# Altium schematic sheet NQX23103A-RX-V2.1-(N32WB031_QFN32_NU1680).SchDoc
size 469 x 330 mm; SheetNumber: 1; SheetTotal: 1
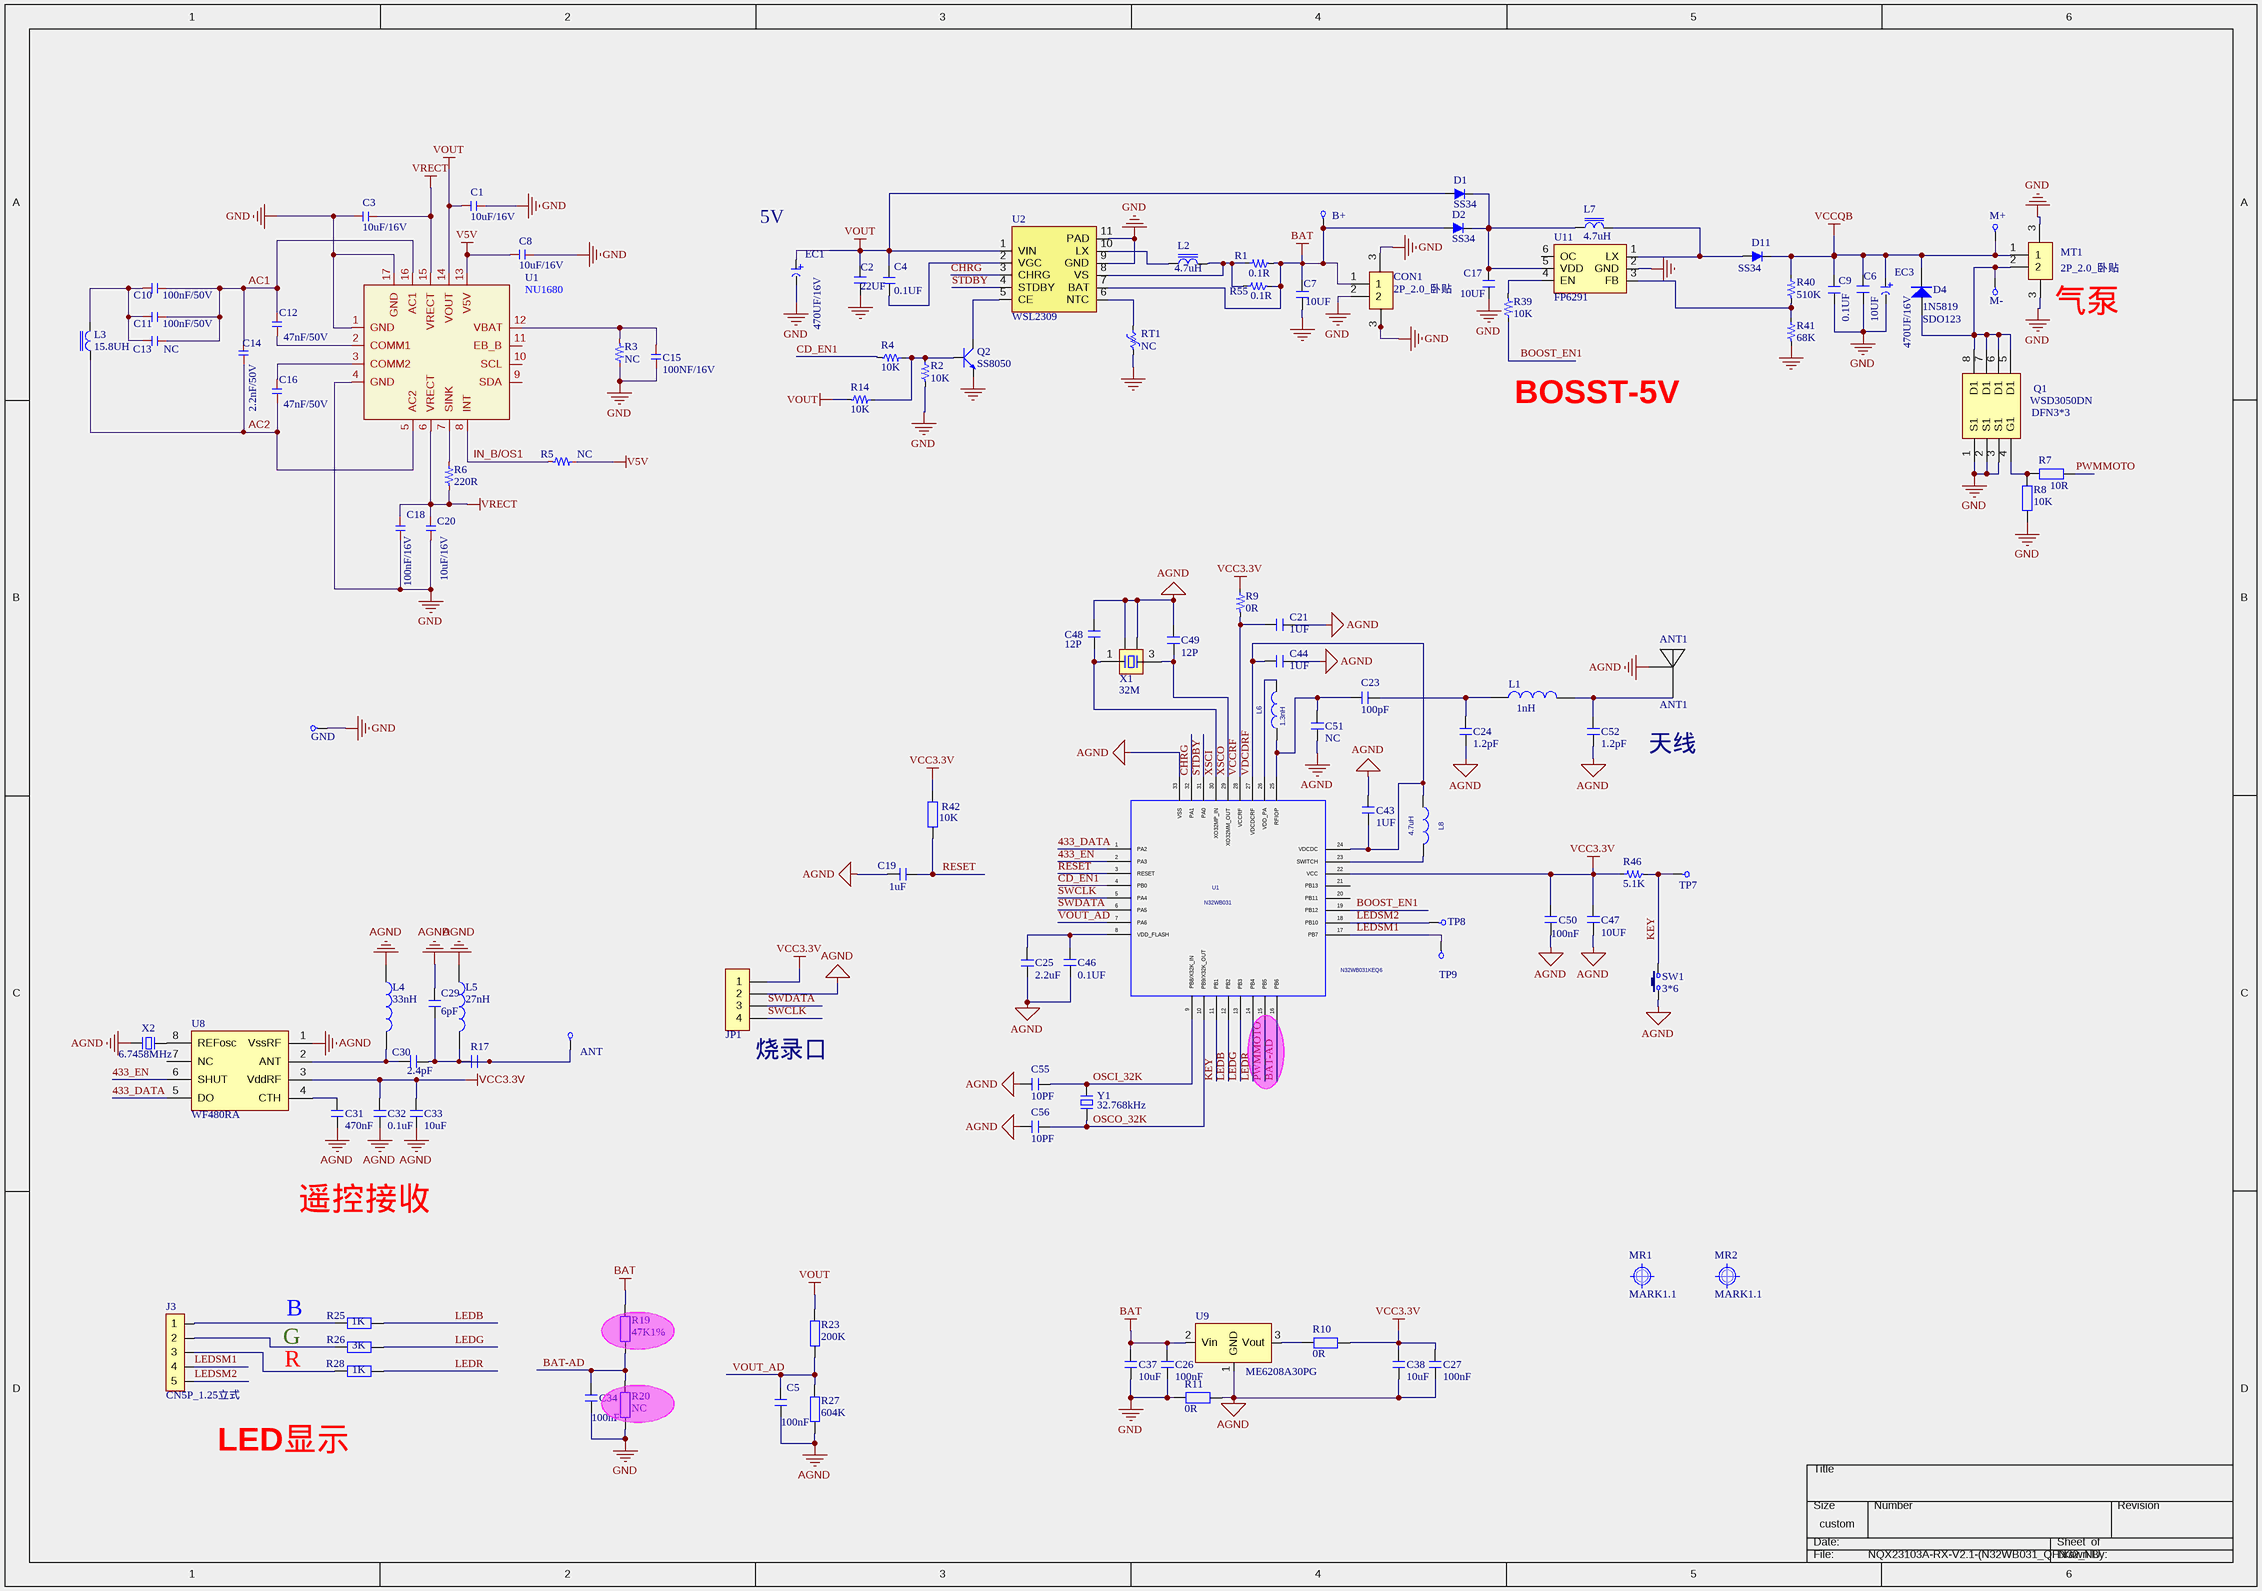
[diagram p0: NQX23103A-RX-V2.1-(N32WB031_QFN32_NU1680).SchDoc]

## Parts
(Parts that share a designator on the sheet are numbered #1, #2 ... from top to bottom, then left to right.)
ANT  TEST  [ANT3]  (value not drawn)
ANT1  ANT1  [ANT-BLUE]
B+  TEST  [TP1.6D]  (value not drawn)
C1  10uF/16V  [C0603-T]
C2  22UF  [C0805-T]
C3  10uF/16V  [C0603-T]
C4  0.1UF  [C0603-T]
C5  100nF  [C0603-T]
C6  10UF  [C0603-T]
C7  10UF  [C0603-T]
C8  10uF/16V  [C0603-T]
C9  0.1UF  [C0603-T]
C10  100nF/50V  [C1206-T]
C11  100nF/50V  [C1206-T]
C12  47nF/50V  [C0603-T]
C13  NC  [C1206-T]
C14  2.2nF/50V  [C0603-T]
C15  100NF/16V  [C0603-T]
C16  47nF/50V  [C0603-T]
C17  10UF  [C0603-T]
C18  100nF/16V  [C0603-T]
C19  1uF  [C0603-T]
C20  10uF/16V  [C0603-T]
C21  1UF  [C0603-T]
C23  100pF  [C0603-T]
C24  1.2pF  [C0603-T]
C25  2.2uF  [C0603-T]
C26  100nF  [C0603-T]
C27  100nF  [C0603-T]
C29  6pF  [C0603-T]
C30  2.4pF  [C0603-T]
C31  470nF  [C0603-T]
C32  0.1uF  [C0603-T]
C33  10uF  [C0603-T]
C34  100nF  [C0603-T]
C37  10uF  [C0603-T]
C38  10uF  [C0603-T]
C43  1UF  [C0603-T]
C44  1UF  [C0603-T]
C46  0.1UF  [C0603-T]
C47  10UF  [C0603-T]
C48  12P  [C0603-T]
C49  12P  [C0603-T]
C50  100nF  [C0603-T]
C51  NC  [C0603-T]
C52  1.2pF  [C0603-T]
C55  10PF  [C0603-T]
C56  10PF  [C0603-T]
CON1  2P_2.0_卧贴  [PH2.0-WT-2P]
D1  SS34  [SMA]
D2  SS34  [SMA]
D4  1N5819  封装: SDO123  [SOD-123]
D11  SS34  [SMA]
EC1  470UF/16V  [EC6.3-P2.5mm-R]
EC3  470UF/16V  [EC6.3-P2.5mm-L]
GND  TEST  [TP1.6D]  (value not drawn)
J3  CN5P_1.25立式  [CON-5P-1.25-90]
JP1  HDR-1X4  [CN4P2.0]  (value not drawn)
L1  1nH  [R0603-T]
L2  4.7uH  [L5X5]
L3  15.8UH  [L5-S]
L4  33nH  [R0603-T]
L5  27nH  [R0603-T]
L6  1.3nH  [R0603-T]
L7  4.7uH  [L5X5]
L8  4.7uH  [R0603-T]
M+  TEST  [TP1.6D]  (value not drawn)
M-  TEST  [TP1.6D]  (value not drawn)
MR1  MARK1.1  [Mark]
MR2  MARK1.1  [Mark]
MT1  2P_2.0_卧贴  [PH2.0-WT-2P]
Q1  WSD3050DN  FZ: DFN3*3  [DFN3X3_8P]
Q2  SS8050  [SOT-23]
R1  0.1R  [R0805-T]
R2  10K  [R0603-T]
R3  NC  [R0603-T]
R4  10K  [R0603-T]
R5  NC  [R0603-T]
R6  220R  [R0805-T]
R7  10R  [R0603-T]
R8  10K  [R0603-T]
R9  0R  [R0603-T]
R10  0R  [R0603-T]
R11  0R  [R0603-T]
R14  10K  [R0603-T]
R17  (no value)  [C0603-T]
R19  47K1%  [R0603-T]
R20  NC  [R0603-T]
R23  200K  [R0603-T]
R25  1K  [R0603-T]
R26  3K  [R0603-T]
R27  604K  [R0603-T]
R28  1K  [R0603-T]
R39  10K  [R0603-T]
R40  510K  [R0603-T]
R41  68K  [R0603-T]
R42  10K  [R0603-T]
R46  5.1K  [R0603-T]
R55  0.1R  [R0805-T]
RT1  NC  [R0805A]
SW1  3*6  [SW 3*6*4.3-S-W]
TP7  TEST  [TP1.0S]  (value not drawn)
TP8  TEST  [TP1.0S]  (value not drawn)
TP9  TEST  [TP1.0S]  (value not drawn)
U1#1  NU1680  [DFN16-3X3]
U1#2  N32WB031KEQ6  value N32WB031  [QFN32_4X4MM]
U2  WSL2309  [TDFN-10_L3.0-W3.0-P0.50-BL-EP]
U8  WF480RA  [SOP8_M]
U9  ME6208A30PG  [SOT-89]
U11  FP6291  [SOT-23-6]
X1  32M  [OSC3225]
X2  6.7458MHz  [OSC-3x8-WI-B]
Y1  32.768kHz  [OSC-3x8-WI-B]

## Nets
AGND: ANT1.2 C5.1 C19.1 C21.1 C24.1 C25.1 C27.1 C29.1 C31.1 C32.1 C33.1 C38.1 C43.1 C44.1 C46.2 C47.2 C48.2 C49.2 C50.2 C51.1 C52.1 C55.1 C56.1 JP1.2 L4.1 L5.1 R11.1 R27.1 SW1.1 U1#2.33(VSS) U8.1(VssRF) U9.1(GND) X1.2 X1.4 X2.1
BAT: B+.1 C7.1 C26.2 C37.2 CON1.1 D2.1(a) R1.1 R19.2 R55.1 U2.7(BAT) U9.2(Vin)
GND: C1.1 C2.2 C3.2 C6.2 C7.2 C8.1 C9.1 C15.2 C17.2 C18.2 C20.2 C26.1 C34.1 C37.1 CON1.2 CON1.3 EC1.2 EC3.2 GND.1 MT1.3 Q1.1(S1) Q1.2(S1) Q1.3(S1) Q2.2(E) R2.1 R3.2 R8.2 R11.2 R20.1 R41.1 RT1.1 U1#1.1(GND) U1#1.4(GND) U1#1.17(GND) U2.9(GND) U2.11(PAD) U11.2(GND)
V5V: C8.2 R5.2 U1#1.13(V5V)
VCC3.3V: C27.2 C32.2 C33.2 C38.2 C47.1 C50.1 JP1.1 R9.2 R10.1 R42.1 R46.2 U1#2.22(VCC) U8.3(VddRF)
VCCQB: C6.1 C9.2 D4.2(K) D11.2(k) EC3.1 M+.1 MT1.1 R40.2
VOUT: C1.2 C2.1 C4.2 D1.1(a) EC1.1 R14.1 R23.2 U1#1.14(VOUT) U2.1(VIN)
VRECT: C3.1 C18.1 C20.1 R6.1 U1#1.6(VRECT) U1#1.15(VRECT)
433_DATA: U1#2.1(PA2) U8.5(DO)
433_EN: U1#2.2(PA3) U8.6(SHUT)
AC1: C10.1 C11.1 C12.2 C13.1 C14.1 U1#1.16(AC1)
AC2: C14.2 C16.1 L3.1 U1#1.5(AC2)
BAT-AD: C34.2 R19.1 R20.2 U1#2.16(PB6)
BOOST_EN1: R39.2 U1#2.19(PB12)
CD_EN1: R4.1 U1#2.4(PB0)
CHRG: U1#2.32(PA1) U2.3(CHRG)
IN_B/OS1: R5.1 U1#1.8(INT)
KEY: R46.1 SW1.2 TP7.1 U1#2.11(PB1)
LEDB: R25.2 U1#2.12(PB2)
LEDG: R26.2 U1#2.13(PB3)
LEDR: R28.2 U1#2.14(PB4)
LEDSM1: J3.4 TP9.1 U1#2.17(PB7)
LEDSM2: J3.5 TP8.1 U1#2.18(PB10)
OSCI_32K: C55.2 U1#2.9(PB8/X32K_IN) Y1.1
OSCO_32K: C56.2 U1#2.10(PB9/X32K_OUT) Y1.2
PWMMOTO: R7.2 U1#2.15(PB5)
RESET: C19.2 R42.2 U1#2.3(RESET)
STDBY: U1#2.31(PA0) U2.4(STDBY)
SWCLK: JP1.4 U1#2.5(PA4)
SWDATA: JP1.3 U1#2.6(PA5)
VCCRF: C21.2 R9.1 U1#2.28(VCCRF)
VDCDRF: C43.2 C44.2 L8.2 U1#2.24(VDCDC) U1#2.27(VDCDCRF)
VOUT_AD: C5.2 R23.1 R27.2 U1#2.7(PA6)
XSCI: C48.1 U1#2.30(XO32MP_IN) X1.1
XSCO: C49.1 U1#2.29(XO32MM_OUT) X1.3
NetANT1_1: ANT1.1 C52.2 L1.2
NetANT_1: ANT.1 C29.2 C30.2 L5.2 R17.1 R17.2
NetC4_1: C4.1 U2.2(VGC)
NetC10_2: C10.2 C11.2 C13.2 L3.2
NetC12_1: C12.1 U1#1.2(COMM1)
NetC15_1: C15.1 R3.1 U1#1.12(VBAT)
NetC16_2: C16.2 U1#1.3(COMM2)
NetC17_1: C17.1 D1.2(k) D2.2(k) L7.1 U11.5(VDD)
NetC23_1: C23.1 C24.2 L1.1
NetC23_2: C23.2 C51.2 L6.2 U1#2.25(RFIOP)
NetC25_2: C25.2 C46.1 U1#2.8(VDD_FLASH)
NetC30_1: C30.1 L4.2 U8.2(ANT)
NetC31_2: C31.2 U8.4(CTH)
NetD4_1: D4.1(A) M-.1 MT1.2 Q1.5(D1) Q1.6(D1) Q1.7(D1) Q1.8(D1)
NetD11_1: D11.1(a) L7.2 U11.1(LX)
NetJ3_1: J3.1 R25.1
NetJ3_2: J3.2 R26.1
NetJ3_3: J3.3 R28.1
NetL2_1: L2.1 U2.10(LX)
NetL2_2: L2.2 R1.2 R55.2 U2.8(VS)
NetL6_1: L6.1 U1#2.26(VDD_PA)
NetL8_1: L8.1 U1#2.23(SWITCH)
NetQ1_4: Q1.4(G1) R7.1 R8.1
NetQ2_1: Q2.1(B) R2.2 R4.2 R14.2
NetQ2_3: Q2.3(C) U2.5(CE)
NetR6_2: R6.2 U1#1.7(SINK)
NetR10_2: R10.2 U9.3(Vout)
NetR39_1: R39.1 U11.4(EN)
NetR40_1: R40.1 R41.2 U11.3(FB)
NetRT1_2: RT1.2 U2.6(NTC)
NetU8_8: U8.8(REFosc) X2.2

Not connected (* = marked no-connect by the designer): U1#1 9(SDA) 10(SCL) 11(EB_B); U1#2 20(PB11) 21(PB13); U8 7(NC); U11 6(OC)

## Notes on the sheet
- (near EC1) 5V
- (near MT1) 气泵
- BOSST-5V
- 天线
- (near JP1) 烧录口
- 遥控接收
- G
- B
- R
- LED显示
- THIS DOCUMENT AND THE DATA DISCLOSED HEREIN OR
- HEREWITH IS THE PROPERTY OF ALTIUM LIMITED AND MAY
- DWG NO:
- REVISION
- REV:
- DESCRIPTION
- DATE
- APPROVED
- BE FREELY DISTRIBUTED IN WHOLE. NO RIGHTS ARE
- RESERVED OR EXPRESS OR IMPLIED WARANTEE GIVEN.
- ENG:
- APPROVALS
- PROJECT
- DSN:
- CHK:
- REFERENCE DOCUMENTS
- PROJECT REVISION:
- TITLE
- DOCUMENT REVISION:
- DESIGN ITEM:
- BOM:
- FAB DWG:
- PCB DWG:
- ASSY DWG:
- SCALE:
- A3
- SIZE
- CAGE CODE
- FILE NAME
- DWG NO.
- SHEET
- OF
- REV

## Library data of the parts
ANT = TEST: 测试点
ANT1 = ANT2_1: PCB板载天线; 版权归属: 封装库来自淘宝 ID：黄晶宝石; BOM名称: PCB板载天线; 技术支持，联系售后: https://shop463601444.taobao.com
B+ GND M+ M- TP7-TP9 = TP20: 测试点
C1 C3 C8 C10-C16 C18 C20 = Cap CC: Value: ?
C2 C4-C7 C9 C17 C21 C26 C27 C29-C34 C37 C38 C43 C44 C46-C50 R17 = C: 贴片电容; 唯一出售店铺网址: https://shop463601444.taobao.com
C19 C23-C25 C51 C52 C55 C56 = C: 贴片电容; BOM名称: 无极性贴片电容; 淘宝ID: 封装库来自淘宝 ID：黄晶宝石; 联系售后，技术支持: https://shop463601444.taobao.com; 唯一出售店铺网址: https://shop463601444.taobao.com
CON1 MT1 = Header 2: 联系售后: https://shop463601444.taobao.com
D1 D2 D11 = Diode: Value: ?
D4 = 1N4148: 开关二极管; BOM名称: 高速开关二极管; 欢迎光临: https://shop463601444.taobao.com
EC1 EC3 = Cap EC: Value: ?
J3 = Header 5: Value: ?
JP1 = Header 4: 学习资源: https://shop463601444.taobao.com
L1 = L: 小功率贴片电感; 淘宝ID: 封装库来自淘宝 ID：黄晶宝石; 封装库来自淘宝卖家 ID：黄晶宝石: 其他店铺购入均为盗版，不享受售后技术支持服务，请立即申请退款; BOM名称: 小功率贴片电感; 联系售后: https://shop463601444.taobao.com
L2 L3 L7 = Inductor Iron: Value: ?
L4 L5 = L: 联系售后: https://shop463601444.taobao.com
L6 L8 = INDUCTOR_0402: MOLDED INDUCTOR, 0.5" PIN SPACING; Sim.Analog.Order: Model$; Sim.Analog.Prefix: L; PCB DECAL: RF0402
  L6: Value: 1.3nH
MR1 MR2 = MARK: 光学定位点; 联系下单店铺卖家 免费技术支持: 联系下单店铺卖家 免费帮你查找封装; BOM名称: 光学定位点
Q1 = WSD3050DN: WSD3050DN NMOS
Q2 = Q-NPN1: Value: ?
R1 R2 R4 R9 R14 R39-R41 R46 R55 = Res: Value: ?
R3 R5 R6 = Res: 贴片电阻; Value: ?
R7 R8 R10 R11 R19 R20 R23 R25-R28 = R: 贴片电阻; BOM名称: 贴片电阻; 联系售后: https://shop463601444.taobao.com
R42 = R: 贴片电阻; 版权归属: 来自淘宝 ID：黄晶宝石; 封装库来自淘宝卖家 ID：黄晶宝石: 其他店铺购入均为盗版，不享受售后技术支持服务，请立即申请退款; BOM名称: 贴片电阻; 联系售后: https://shop463601444.taobao.com
RT1 = Res-RT: Value: ?
SW1 = TSW DIP-6x6_V: 技术支持，联系售后: https://shop463601444.taobao.com
U1#1 = NU1680-QFN17-3X3: 伏达NU1680,5W无线充接收芯片
U1#2 = NS7300_1A_QFN32: PCB DECAL: QFN32_4X4MM
U2 = SLM6305: 2.5A宽电压同步降压充电IC
U8 = WF480RA: WF480RA无线接收芯片
U9 = ME6209A36_SOT23-6
U11 = FP6291_SOT23-6
X1 = XTAL-4P: 4脚无源晶振(谐振器）; 联系下单店铺卖家 免费帮你查找封装: 联系下单店铺卖家 免费技术支持; BOM名称: 4脚无源晶振(谐振器）
X2 = XTAL-2P: 2脚无源脚晶振; BOM名称: 2脚无源脚晶振; 学习资源: https://shop463601444.taobao.com
Y1 = XTAL-2P: 2脚无源脚晶振; 版权归属: 封装库来自淘宝卖家 ID：黄晶宝石; BOM名称: 2脚无源脚晶振; 学习资源: https://shop463601444.taobao.com